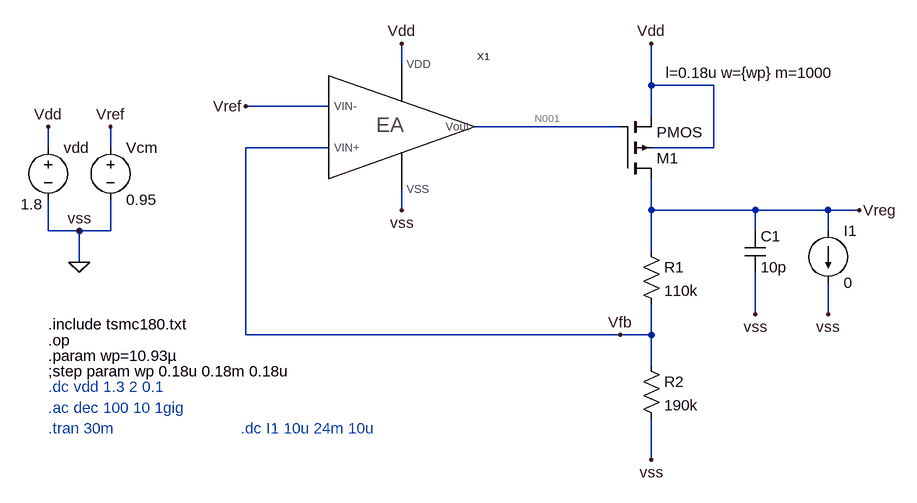
[diagram p0: schematic ldo_24mA.asc]
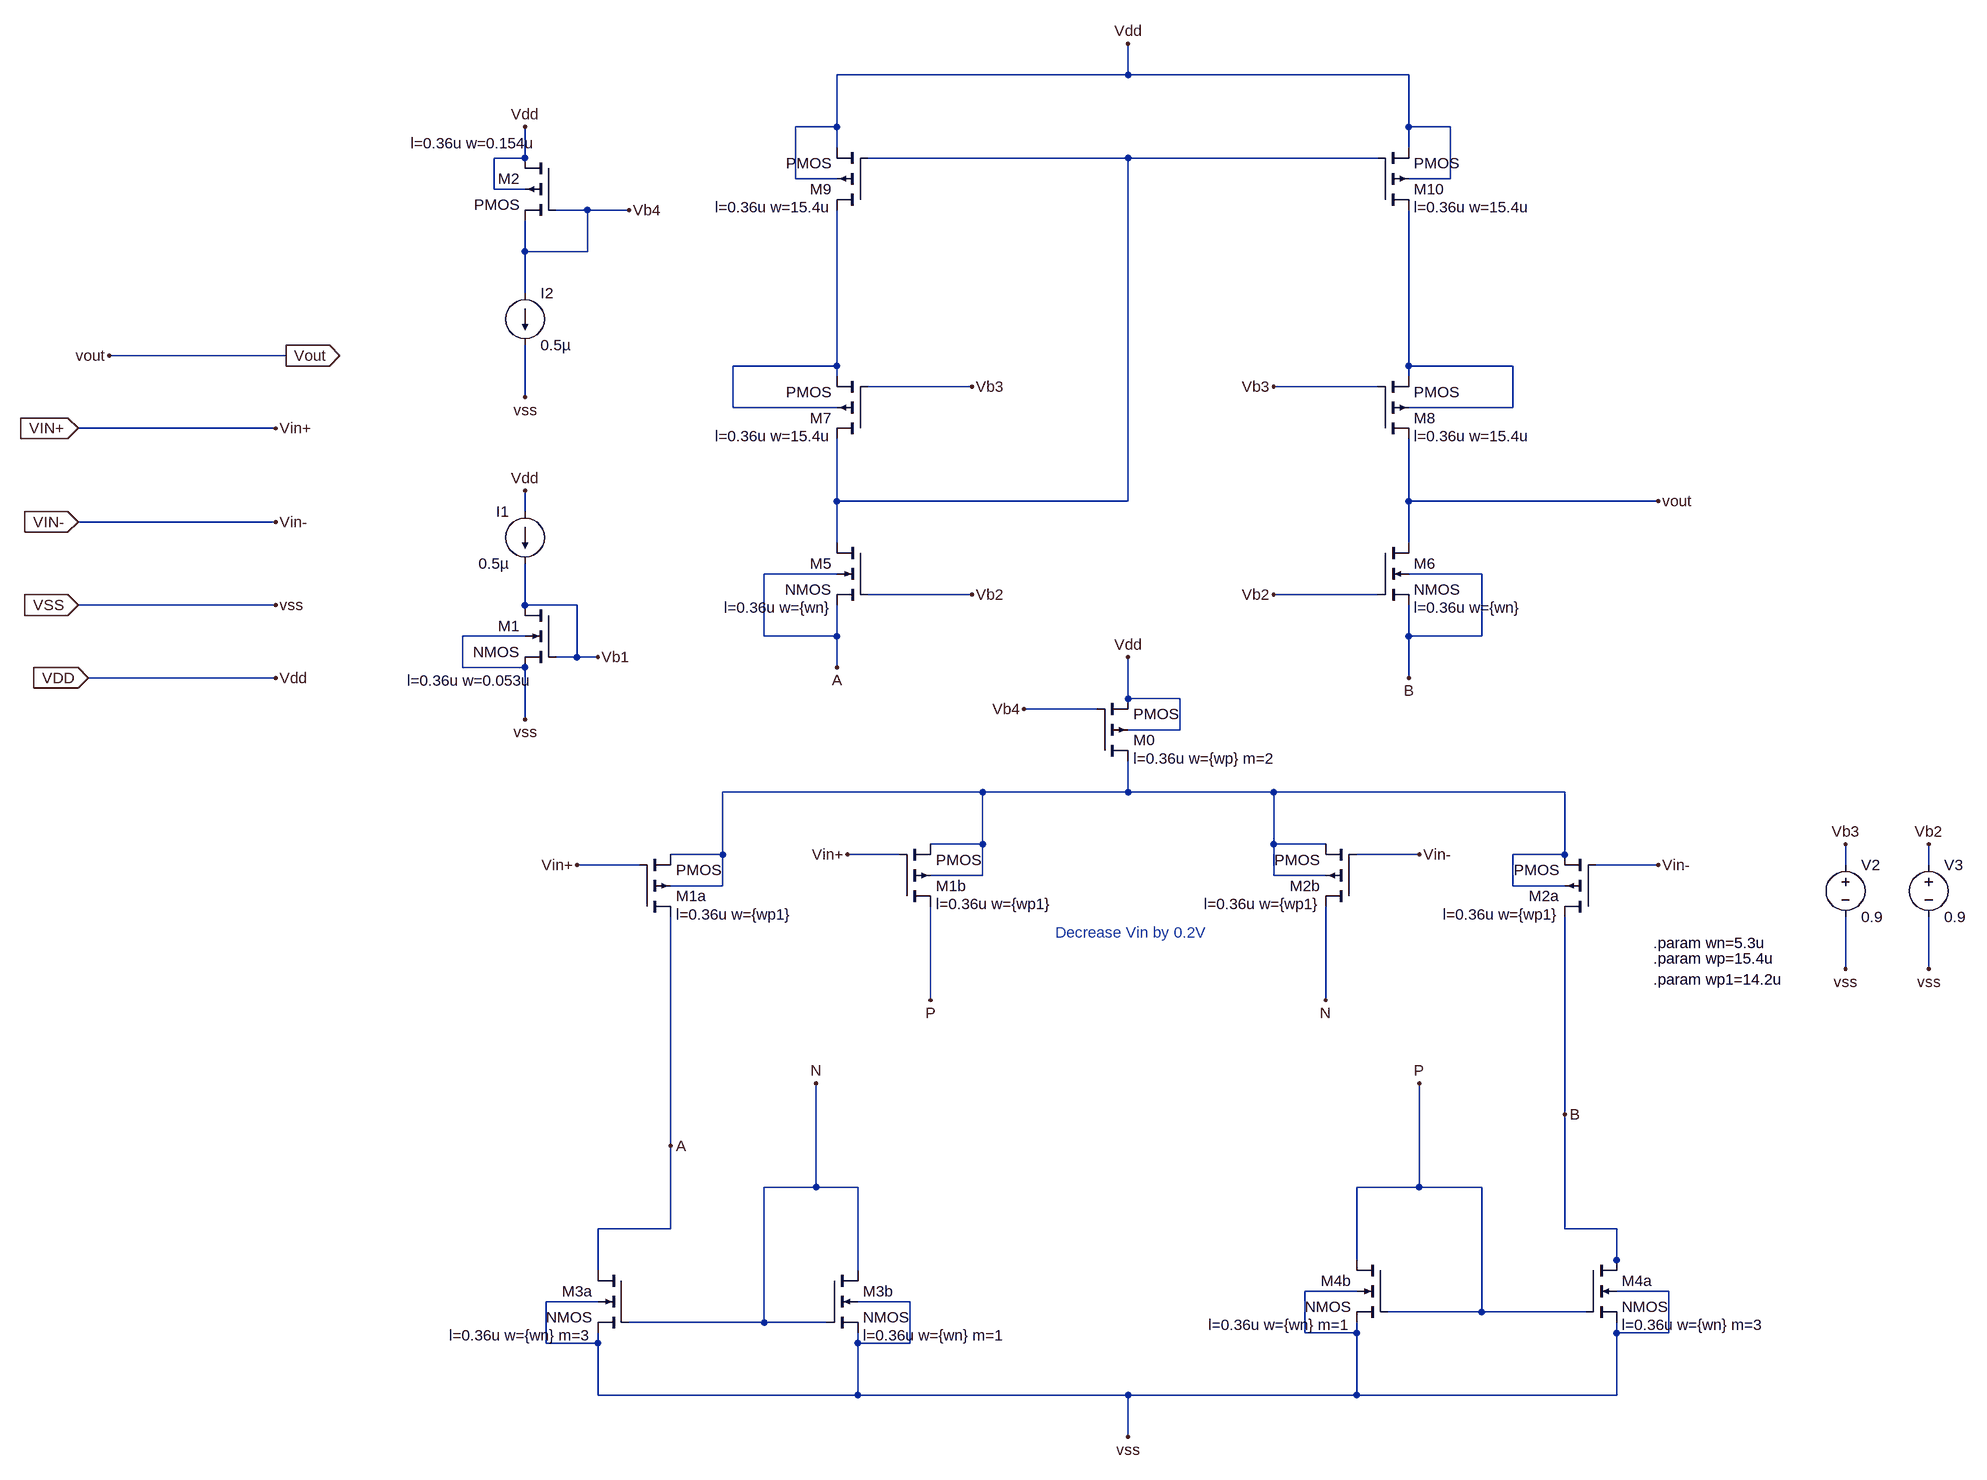
[diagram p1: sub-circuit error_amp.asc]
ldo_24mA.asc, the LTspice schematic file:
Version 4
SHEET 1 1856 756
WIRE 224 64 224 32
WIRE 608 96 608 32
WIRE 704 96 608 96
WIRE 112 128 -16 128
WIRE 608 144 608 96
WIRE 560 160 336 160
WIRE -320 192 -320 160
WIRE -224 192 -224 160
WIRE 112 192 -16 192
WIRE 704 192 704 96
WIRE 704 192 608 192
WIRE 224 288 224 256
WIRE 608 288 608 240
WIRE 768 288 608 288
WIRE 880 288 768 288
WIRE 928 288 880 288
WIRE -320 320 -320 272
WIRE -272 320 -320 320
WIRE -224 320 -224 272
WIRE -224 320 -272 320
WIRE 768 320 768 288
WIRE 880 320 880 288
WIRE 608 352 608 288
WIRE -272 368 -272 320
WIRE 768 448 768 384
WIRE 880 448 880 400
WIRE -16 480 -16 192
WIRE 560 480 -16 480
WIRE 608 480 608 432
WIRE 608 480 560 480
WIRE 608 528 608 480
WIRE 608 672 608 608
FLAG -16 128 Vref
FLAG -224 160 Vref
FLAG -272 368 0
FLAG -272 320 vss
FLAG 224 288 vss
FLAG 224 32 Vdd
FLAG -320 160 Vdd
FLAG 608 672 vss
FLAG 768 448 vss
FLAG 880 448 vss
FLAG 928 288 Vreg
FLAG 608 32 Vdd
FLAG 560 480 Vfb
DATAFLAG 640 288 ""
DATAFLAG 416 480 ""
SYMBOL Error_amp 192 144 R0
SYMATTR InstName X1
SYMBOL voltage -224 176 R0
WINDOW 123 24 124 Left 2
WINDOW 39 0 0 Left 0
SYMATTR InstName Vcm
SYMATTR Value 0.95
SYMBOL voltage -320 176 R0
WINDOW 123 24 124 Left 2
WINDOW 39 0 0 Left 0
WINDOW 3 -42 103 Left 2
SYMATTR Value 1.8
SYMATTR InstName vdd
SYMBOL res 592 336 R0
SYMATTR InstName R1
SYMATTR Value 110k
SYMBOL res 592 512 R0
SYMATTR InstName R2
SYMATTR Value 190k
SYMBOL pmos4 560 240 M180
WINDOW 123 70 163 Left 2
SYMATTR Value2 l=0.18u w={wp} m=1000
SYMATTR InstName M1
SYMBOL current 880 320 R0
WINDOW 123 0 0 Left 0
WINDOW 39 0 0 Left 0
SYMATTR InstName I1
SYMATTR Value 0
SYMBOL cap 752 320 R0
SYMATTR InstName C1
SYMATTR Value 10p
TEXT -320 464 Left 2 !.include tsmc180.txt
TEXT -320 488 Left 2 !.op
TEXT -320 512 Left 2 !.param wp=10.93µ
TEXT -320 536 Left 2 !;step param wp 0.18u 0.18m 0.18u
TEXT -320 560 Left 2 ;.dc vdd 1.3 2 0.1
TEXT -320 592 Left 2 ;.ac dec 100 10 1gig
TEXT -320 624 Left 2 ;.tran 30m
TEXT -24 624 Left 2 ;.dc I1 10u 24m 10u

error_amp.asc, the sub-circuit schematic file:
Version 4
SHEET 1 4352 1320
WIRE -896 -1344 -896 -1392
WIRE -896 -1344 -1344 -1344
WIRE -464 -1344 -896 -1344
WIRE -1344 -1264 -1344 -1344
WIRE -1344 -1264 -1408 -1264
WIRE -464 -1264 -464 -1344
WIRE -400 -1264 -464 -1264
WIRE -1344 -1232 -1344 -1264
WIRE -464 -1232 -464 -1264
WIRE -1824 -1216 -1824 -1264
WIRE -1824 -1216 -1872 -1216
WIRE -896 -1216 -1296 -1216
WIRE -512 -1216 -896 -1216
WIRE -1408 -1184 -1408 -1264
WIRE -1344 -1184 -1408 -1184
WIRE -400 -1184 -400 -1264
WIRE -400 -1184 -464 -1184
WIRE -1872 -1168 -1872 -1216
WIRE -1824 -1168 -1872 -1168
WIRE -1728 -1136 -1776 -1136
WIRE -1664 -1136 -1728 -1136
WIRE -1824 -1072 -1824 -1120
WIRE -1728 -1072 -1728 -1136
WIRE -1728 -1072 -1824 -1072
WIRE -1824 -1008 -1824 -1072
WIRE -2192 -912 -2464 -912
WIRE -1344 -896 -1344 -1136
WIRE -1344 -896 -1504 -896
WIRE -464 -896 -464 -1136
WIRE -304 -896 -464 -896
WIRE -1344 -880 -1344 -896
WIRE -464 -880 -464 -896
WIRE -1136 -864 -1296 -864
WIRE -512 -864 -672 -864
WIRE -1824 -848 -1824 -928
WIRE -1504 -832 -1504 -896
WIRE -1344 -832 -1504 -832
WIRE -304 -832 -304 -896
WIRE -304 -832 -464 -832
WIRE -2208 -800 -2512 -800
WIRE -1344 -688 -1344 -784
WIRE -896 -688 -896 -1216
WIRE -896 -688 -1344 -688
WIRE -464 -688 -464 -784
WIRE -80 -688 -464 -688
WIRE -1824 -672 -1824 -704
WIRE -2208 -656 -2512 -656
WIRE -1344 -624 -1344 -688
WIRE -464 -624 -464 -688
WIRE -1344 -576 -1456 -576
WIRE -352 -576 -464 -576
WIRE -1136 -544 -1296 -544
WIRE -512 -544 -672 -544
WIRE -2208 -528 -2512 -528
WIRE -1824 -528 -1824 -592
WIRE -1744 -528 -1824 -528
WIRE -1824 -480 -1920 -480
WIRE -1456 -480 -1456 -576
WIRE -1344 -480 -1344 -528
WIRE -1344 -480 -1456 -480
WIRE -464 -480 -464 -528
WIRE -352 -480 -352 -576
WIRE -352 -480 -464 -480
WIRE -1744 -448 -1744 -528
WIRE -1744 -448 -1776 -448
WIRE -1712 -448 -1744 -448
WIRE -1920 -432 -1920 -480
WIRE -1824 -432 -1920 -432
WIRE -1344 -432 -1344 -480
WIRE -2208 -416 -2496 -416
WIRE -464 -416 -464 -480
WIRE -896 -384 -896 -448
WIRE -816 -384 -896 -384
WIRE -944 -368 -1056 -368
WIRE -1824 -352 -1824 -432
WIRE -816 -336 -816 -384
WIRE -816 -336 -896 -336
WIRE -1120 -240 -1520 -240
WIRE -896 -240 -896 -288
WIRE -896 -240 -1120 -240
WIRE -672 -240 -896 -240
WIRE -224 -240 -672 -240
WIRE -1120 -160 -1120 -240
WIRE -1120 -160 -1200 -160
WIRE -672 -160 -672 -240
WIRE -592 -160 -672 -160
WIRE -1520 -144 -1520 -240
WIRE -1520 -144 -1600 -144
WIRE -1248 -144 -1328 -144
WIRE -448 -144 -544 -144
WIRE -224 -144 -224 -240
WIRE -224 -144 -304 -144
WIRE -1648 -128 -1744 -128
WIRE -80 -128 -176 -128
WIRE 208 -128 208 -160
WIRE 336 -128 336 -160
WIRE -1120 -112 -1120 -160
WIRE -1120 -112 -1200 -112
WIRE -672 -112 -672 -160
WIRE -592 -112 -672 -112
WIRE -1520 -96 -1520 -144
WIRE -1520 -96 -1600 -96
WIRE -304 -96 -304 -144
WIRE -224 -96 -304 -96
WIRE 208 32 208 -48
WIRE 336 32 336 -48
WIRE -1200 80 -1200 -64
WIRE -592 80 -592 -64
WIRE -224 256 -224 -48
WIRE -1600 304 -1600 -48
WIRE -1376 368 -1376 208
WIRE -1376 368 -1456 368
WIRE -1312 368 -1376 368
WIRE -448 368 -448 208
WIRE -448 368 -544 368
WIRE -352 368 -448 368
WIRE -1600 432 -1600 304
WIRE -1600 432 -1712 432
WIRE -224 432 -224 256
WIRE -144 432 -224 432
WIRE -544 480 -544 368
WIRE -144 480 -144 432
WIRE -1712 496 -1712 432
WIRE -1312 496 -1312 368
WIRE -144 496 -144 480
WIRE -544 528 -624 528
WIRE -64 528 -144 528
WIRE -1712 544 -1792 544
WIRE -1232 544 -1312 544
WIRE -352 560 -352 368
WIRE -352 560 -496 560
WIRE -192 560 -352 560
WIRE -1456 576 -1456 368
WIRE -1456 576 -1664 576
WIRE -1360 576 -1456 576
WIRE -624 592 -624 528
WIRE -544 592 -544 576
WIRE -544 592 -624 592
WIRE -144 592 -144 576
WIRE -64 592 -64 528
WIRE -64 592 -144 592
WIRE -1792 608 -1792 544
WIRE -1712 608 -1712 592
WIRE -1712 608 -1792 608
WIRE -1312 608 -1312 592
WIRE -1232 608 -1232 544
WIRE -1232 608 -1312 608
WIRE -1712 688 -1712 608
WIRE -1312 688 -1312 608
WIRE -1312 688 -1712 688
WIRE -896 688 -1312 688
WIRE -544 688 -544 592
WIRE -544 688 -896 688
WIRE -144 688 -144 592
WIRE -144 688 -544 688
WIRE -896 752 -896 688
FLAG -1712 -448 Vb1
FLAG -1824 -704 Vdd
FLAG -1824 -1264 Vdd
FLAG -1664 -1136 Vb4
FLAG -1136 -864 Vb3
FLAG -1136 -544 Vb2
FLAG 208 -160 Vb3
FLAG 336 -160 Vb2
FLAG -1744 -128 Vin+
FLAG -896 -1392 Vdd
FLAG -672 -864 Vb3
FLAG -672 -544 Vb2
FLAG -80 -128 Vin-
FLAG -1056 -368 Vb4
FLAG -896 -448 Vdd
FLAG -1344 -432 A
FLAG -1600 304 A
FLAG -224 256 B
FLAG -464 -416 B
FLAG -1376 208 N
FLAG -592 80 N
FLAG -1200 80 P
FLAG -448 208 P
FLAG -1328 -144 Vin+
FLAG -448 -144 Vin-
FLAG -80 -688 vout
FLAG -2192 -912 Vout
IOPIN -2192 -912 Out
FLAG -2512 -800 VIN+
IOPIN -2512 -800 In
FLAG -2512 -656 VIN-
IOPIN -2512 -656 In
FLAG -2512 -528 VSS
IOPIN -2512 -528 In
FLAG -2496 -416 VDD
IOPIN -2496 -416 In
FLAG -2208 -416 Vdd
FLAG -2208 -800 Vin+
FLAG -2208 -656 Vin-
FLAG -2464 -912 vout
FLAG -1824 -352 vss
FLAG -1824 -848 vss
FLAG -2208 -528 vss
FLAG -896 752 vss
FLAG 208 32 vss
FLAG 336 32 vss
DATAFLAG -1344 -960 ""
DATAFLAG -208 -688 ""
DATAFLAG -464 -960 ""
SYMBOL nmos4 -1776 -528 M0
WINDOW 123 37 116 Left 2
SYMATTR Value2 l=0.36u w=0.053u
SYMATTR InstName M1
SYMBOL current -1824 -672 M0
WINDOW 123 0 0 Left 0
WINDOW 39 0 0 Left 0
SYMATTR InstName I1
SYMATTR Value 0.5µ
SYMBOL pmos4 -1776 -1216 M0
WINDOW 123 31 -23 Left 2
SYMATTR Value2 l=0.36u w=0.154u
SYMATTR InstName M2
SYMBOL current -1824 -1008 R0
WINDOW 123 0 0 Left 0
WINDOW 39 0 0 Left 0
SYMATTR InstName I2
SYMATTR Value 0.5µ
SYMBOL pmos4 -1296 -1136 R180
WINDOW 123 56 4 Left 2
SYMATTR Value2 l=0.36u w=15.4u
SYMATTR InstName M9
SYMBOL pmos4 -1296 -784 R180
WINDOW 123 56 4 Left 2
SYMATTR Value2 l=0.36u w=15.4u
SYMATTR InstName M7
SYMBOL nmos4 -1296 -624 M0
WINDOW 123 56 100 Left 2
SYMATTR Value2 l=0.36u w={wn}
SYMATTR InstName M5
SYMBOL nmos4 -1360 496 R0
WINDOW 123 56 100 Left 2
SYMATTR Value2 l=0.36u w={wn} m=1
SYMATTR InstName M3b
SYMBOL voltage 208 -144 R0
WINDOW 123 0 0 Left 0
WINDOW 39 0 0 Left 0
SYMATTR InstName V2
SYMATTR Value 0.9
SYMBOL voltage 336 -144 R0
WINDOW 123 0 0 Left 0
WINDOW 39 0 0 Left 0
SYMATTR InstName V3
SYMATTR Value 0.9
SYMBOL pmos4 -1648 -48 M180
WINDOW 123 56 4 Left 2
SYMATTR Value2 l=0.36u w={wp1}
SYMATTR InstName M1a
SYMBOL pmos4 -512 -1136 M180
WINDOW 123 56 4 Left 2
SYMATTR Value2 l=0.36u w=15.4u
SYMATTR InstName M10
SYMBOL pmos4 -512 -784 M180
WINDOW 123 56 4 Left 2
SYMATTR Value2 l=0.36u w=15.4u
SYMATTR InstName M8
SYMBOL nmos4 -512 -624 R0
WINDOW 123 56 100 Left 2
SYMATTR Value2 l=0.36u w={wn}
SYMATTR InstName M6
SYMBOL nmos4 -496 480 M0
WINDOW 123 56 100 Left 2
SYMATTR Value2 l=0.36u w={wn} m=1
SYMATTR InstName M4b
SYMBOL pmos4 -176 -48 R180
WINDOW 123 56 4 Left 2
SYMATTR Value2 l=0.36u w={wp1}
SYMATTR InstName M2a
SYMBOL pmos4 -944 -288 M180
WINDOW 123 56 4 Left 2
SYMATTR Value2 l=0.36u w={wp} m=2
SYMATTR InstName M0
SYMATTR Prefix M0
SYMBOL pmos4 -1248 -64 M180
WINDOW 123 56 4 Left 2
SYMATTR Value2 l=0.36u w={wp1}
SYMATTR InstName M1b
SYMBOL nmos4 -1664 496 M0
WINDOW 123 56 100 Left 2
SYMATTR Value2 l=0.36u w={wn} m=3
SYMATTR InstName M3a
SYMBOL pmos4 -544 -64 R180
WINDOW 123 56 4 Left 2
SYMATTR Value2 l=0.36u w={wp1}
SYMATTR InstName M2b
SYMBOL nmos4 -192 480 R0
WINDOW 123 56 100 Left 2
SYMATTR Value2 l=0.36u w={wn} m=3
SYMATTR InstName M4a
TEXT -88 -8 Left 2 !.param wn=5.3u
TEXT -88 16 Left 2 !.param wp=15.4u
TEXT -88 48 Left 2 !.param wp1=14.2u
TEXT -1008 -24 Left 2 ;Decrease Vin by 0.2V

The netlist it stands for:
* ldo_24mA.asc
XX1 Vdd Vfb Vref 0 N001 error_amp
Vcm Vref 0 0.95
vdd Vdd 0 1.8
R1 Vreg Vfb 110k
R2 Vfb 0 190k
M1 Vreg N001 Vdd Vdd PMOS l=0.18u w={wp} m=1000
I1 Vreg 0 0
C1 Vreg 0 10p

* block symbol definitions
.subckt error_amp VDD VIN+ VIN- VSS Vout
M1 Vb1 Vb1 VSS VSS NMOS l=0.36u w=0.053u
I1 Vdd Vb1 0.5µ
M2 Vdd Vb4 Vb4 Vdd PMOS l=0.36u w=0.154u
I2 Vb4 VSS 0.5µ
M9 N002 N001 Vdd Vdd PMOS l=0.36u w=15.4u
M7 N001 Vb3 N002 N002 PMOS l=0.36u w=15.4u
M5 N001 Vb2 A A NMOS l=0.36u w={wn}
M3b N N VSS VSS NMOS l=0.36u w={wn} m=1
V2 Vb3 VSS 0.9
V3 Vb2 VSS 0.9
M1a A Vin+ N004 N004 PMOS l=0.36u w={wp1}
M10 N003 N001 Vdd Vdd PMOS l=0.36u w=15.4u
M8 vout Vb3 N003 N003 PMOS l=0.36u w=15.4u
M6 vout Vb2 B B NMOS l=0.36u w={wn}
M4b P P VSS VSS NMOS l=0.36u w={wn} m=1
M2a B Vin- N004 N004 PMOS l=0.36u w={wp1}
M0 N004 Vb4 Vdd Vdd PMOS l=0.36u w={wp} m=2
M1b P Vin+ N004 N004 PMOS l=0.36u w={wp1}
M3a A N VSS VSS NMOS l=0.36u w={wn} m=3
M2b N Vin- N004 N004 PMOS l=0.36u w={wp1}
M4a B P VSS VSS NMOS l=0.36u w={wn} m=3
.param wn=5.3u
.param wp=15.4u
.param wp1=14.2u
* Decrease Vin by 0.2V
.ends error_amp

.model NMOS NMOS
.model PMOS PMOS
.lib standard.mos
.include tsmc180.txt
.op
.param wp=10.93µ
;step param wp 0.18u 0.18m 0.18u
* .dc vdd 1.3 2 0.1
* .ac dec 100 10 1gig
* .tran 30m
* .dc I1 10u 24m 10u
.backanno
.end

* Results of the author's LTspice run, read from the files saved beside the schematic
* Operating Point:
*   V(vdd) = 1.8 V
*   V(vfb) = 950.7 mV
*   V(n001) = 1.57 V
*   V(vref) = 950 mV
*   V(vreg) = 1.501 V
*   Id(M1) = -5.004 µA
*   Ig(M1) = 0 A
*   Ib(M1) = 308.9 pA
*   Is(M1) = 5.003 µA
*   I(C1) = 0 A
*   I(I1) = 0 A
*   I(R1) = 5.004 µA
*   I(R2) = 5.004 µA
*   I(Vcm) = 0 A
*   I(Vdd) = -127.4 µA
*   Ix(x1:VDD) = 122.4 µA
*   Ix(x1:VIN+) = 0 A
*   Ix(x1:VIN-) = 0 A
*   Ix(x1:VSS) = -122.4 µA
*   Ix(x1:VOUT) = -292.8 pA
* From the log:
*   Semiconductor Device Operating Points:
*                           --- BSIM3 MOSFETS ---
*   Name:      m:x1:1      m:x1:5      m:x1:3b     m:x1:6      m:x1:4b
*   Model:      nmos        nmos        nmos        nmos        nmos
*   Id:        5.00e-07    2.90e-05    1.59e-05    2.84e-05    1.57e-05
*   Vgs:       6.84e-01    6.07e-01    5.74e-01    6.03e-01    5.74e-01
*   Vds:       6.84e-01    9.02e-01    5.74e-01    1.27e+00    5.74e-01
*   Vbs:       0.00e+00    0.00e+00    0.00e+00    0.00e+00    0.00e+00
*   Vth:       5.41e-01    4.67e-01    4.67e-01    4.67e-01    4.67e-01
*   Vdsat:     1.08e-01    1.10e-01    8.85e-02    1.07e-01    8.82e-02
*   Gm:        7.66e-06    4.47e-04    2.88e-04    4.41e-04    2.86e-04
*   Gds:       5.70e-08    3.79e-06    2.64e-06    3.52e-06    2.62e-06
*   Gmb        1.65e-06    1.18e-04    7.67e-05    1.16e-04    7.60e-05
*   Cbd:       0.00e+00    0.00e+00    0.00e+00    0.00e+00    0.00e+00
*   Cbs:       0.00e+00    0.00e+00    0.00e+00    0.00e+00    0.00e+00
*   Cgsov:     4.08e-17    4.08e-15    4.08e-15    4.08e-15    4.08e-15
*   Cgdov:     4.08e-17    4.08e-15    4.08e-15    4.08e-15    4.08e-15
*   Cgbov:     3.33e-19    3.33e-19    3.33e-19    3.33e-19    3.33e-19
*   dQgdVgb:   2.06e-16    2.04e-14    2.02e-14    2.04e-14    2.02e-14
*   dQgdVdb:  -4.08e-17   -4.08e-15   -4.08e-15   -4.08e-15   -4.08e-15
*   dQgdVsb:  -1.50e-16   -1.54e-14   -1.50e-14   -1.54e-14   -1.50e-14
*   dQddVgb:  -8.93e-17   -8.92e-15   -8.77e-15   -8.91e-15   -8.77e-15
*   dQddVdb:   4.08e-17    4.08e-15    4.08e-15    4.08e-15    4.08e-15
*   dQddVsb:   6.00e-17    6.27e-15    6.08e-15    6.25e-15    6.07e-15
*   dQbdVgb:  -2.70e-17   -2.59e-15   -2.62e-15   -2.59e-15   -2.62e-15
*   dQbdVdb:  -2.06e-20   -7.68e-19   -2.47e-18   -1.86e-19   -2.47e-18
*   dQbdVsb:  -1.10e-17   -1.23e-15   -1.20e-15   -1.22e-15   -1.20e-15
*   Name:      m:x1:3a     m:x1:4a     m:x1:2      m:x1:9      m:x1:7
*   Model:      nmos        nmos        pmos        pmos        pmos
*   Id:        4.51e-05    4.47e-05    5.00e-07   -2.90e-05   -2.90e-05
*   Vgs:       5.74e-01    5.74e-01    0.00e+00   -6.06e-01   -6.06e-01
*   Vds:       2.93e-01    2.97e-01    6.13e-01   -2.94e-01   -3.11e-01
*   Vbs:       0.00e+00    0.00e+00    6.13e-01    0.00e+00    0.00e+00
*   Vth:       4.67e-01    4.67e-01   -4.25e-01   -4.73e-01   -4.73e-01
*   Vdsat:     8.85e-02    8.82e-02   -1.61e-01   -1.29e-01   -1.29e-01
*   Gm:        8.27e-04    8.21e-04    5.17e-06    3.73e-04    3.74e-04
*   Gds:       1.03e-05    1.01e-05    5.08e-08    3.75e-06    3.54e-06
*   Gmb        2.20e-04    2.19e-04    1.77e-06    1.17e-04    1.17e-04
*   Cbd:       0.00e+00    0.00e+00    0.00e+00    0.00e+00    0.00e+00
*   Cbs:       0.00e+00    0.00e+00    0.00e+00    0.00e+00    0.00e+00
*   Cgsov:     1.22e-14    1.22e-14    1.09e-16    1.09e-14    1.09e-14
*   Cgdov:     1.22e-14    1.22e-14    1.09e-16    1.09e-14    1.09e-14
*   Cgbov:     9.99e-19    9.99e-19    3.11e-19    3.11e-19    3.11e-19
*   dQgdVgb:   6.06e-14    6.06e-14    5.56e-16    5.52e-14    5.52e-14
*   dQgdVdb:  -1.23e-14   -1.23e-14   -1.09e-16   -1.10e-14   -1.10e-14
*   dQgdVsb:  -4.51e-14   -4.51e-14   -4.44e-16   -4.26e-14   -4.26e-14
*   dQddVgb:  -2.64e-14   -2.64e-14   -2.41e-16   -2.41e-14   -2.41e-14
*   dQddVdb:   1.23e-14    1.23e-14    1.09e-16    1.10e-14    1.10e-14
*   dQddVsb:   1.83e-14    1.83e-14    1.80e-16    1.73e-14    1.73e-14
*   dQbdVgb:  -7.77e-15   -7.78e-15   -7.37e-17   -7.02e-15   -7.03e-15
*   dQbdVdb:  -6.34e-17   -5.99e-17   -1.22e-19   -7.82e-17   -6.52e-17
*   dQbdVsb:  -3.67e-15   -3.66e-15   -2.49e-17   -2.93e-15   -2.93e-15
*   Name:      m:x1:1a     m:x1:10     m:x1:8      m:x1:2a     m:x1:0
*   Model:      pmos        pmos        pmos        pmos        pmos
*   Id:       -1.61e-05   -2.84e-05   -2.84e-05   -1.63e-05   -6.39e-05
*   Vgs:      -5.64e-01   -6.06e-01   -7.11e-01   -5.64e-01   -6.13e-01
*   Vds:      -1.22e+00   -1.89e-01   -4.16e-02   -1.22e+00   -2.86e-01
*   Vbs:       0.00e+00    0.00e+00    0.00e+00    0.00e+00    0.00e+00
*   Vth:      -4.73e-01   -4.73e-01   -4.73e-01   -4.73e-01   -4.73e-01
*   Vdsat:    -1.01e-01   -1.29e-01   -2.09e-01   -1.02e-01   -1.35e-01
*   Gm:        2.53e-04    3.61e-04    1.35e-04    2.54e-04    7.91e-04
*   Gds:       1.44e-06    1.08e-05    6.04e-04    1.46e-06    8.75e-06
*   Gmb        7.94e-05    1.13e-04    4.76e-05    8.00e-05    2.48e-04
*   Cbd:       0.00e+00    0.00e+00    0.00e+00    0.00e+00    0.00e+00
*   Cbs:       0.00e+00    0.00e+00    0.00e+00    0.00e+00    0.00e+00
*   Cgsov:     1.01e-14    1.09e-14    1.09e-14    1.01e-14    2.19e-14
*   Cgdov:     1.01e-14    1.09e-14    1.09e-14    1.01e-14    2.19e-14
*   Cgbov:     3.11e-19    3.11e-19    3.11e-19    3.11e-19    6.21e-19
*   dQgdVgb:   4.96e-14    5.54e-14    6.15e-14    4.96e-14    1.11e-13
*   dQgdVdb:  -1.01e-14   -1.13e-14   -2.42e-14   -1.01e-14   -2.21e-14
*   dQgdVsb:  -3.76e-14   -4.27e-14   -3.77e-14   -3.77e-14   -8.56e-14
*   dQddVgb:  -2.14e-14   -2.43e-14   -3.02e-14   -2.15e-14   -4.83e-14
*   dQddVdb:   1.01e-14    1.13e-14    2.44e-14    1.01e-14    2.21e-14
*   dQddVsb:   1.50e-14    1.74e-14    1.19e-14    1.50e-14    3.48e-14
*   dQbdVgb:  -6.71e-15   -6.79e-15   -1.06e-15   -6.70e-15   -1.40e-14
*   dQbdVdb:  -5.02e-19   -3.31e-16   -1.37e-14   -5.12e-19   -1.89e-16
*   dQbdVsb:  -2.53e-15   -2.98e-15    2.90e-15   -2.53e-15   -5.88e-15
*   Name:      m:x1:1b     m:x1:2b       m1
*   Model:      pmos        pmos        pmos
*   Id:       -1.57e-05   -1.59e-05   -5.00e-06
*   Vgs:      -5.64e-01   -5.64e-01   -2.30e-01
*   Vds:      -9.41e-01   -9.40e-01   -2.99e-01
*   Vbs:       0.00e+00    0.00e+00    0.00e+00
*   Vth:      -4.73e-01   -4.73e-01   -5.23e-01
*   Vdsat:    -1.01e-01   -1.02e-01   -4.08e-02
*   Gm:        2.46e-04    2.48e-04    1.27e-04
*   Gds:       1.45e-06    1.46e-06    1.69e-06
*   Gmb        7.74e-05    7.80e-05    4.48e-05
*   Cbd:       0.00e+00    0.00e+00    0.00e+00
*   Cbs:       0.00e+00    0.00e+00    0.00e+00
*   Cgsov:     1.01e-14    1.01e-14    7.77e-12
*   Cgdov:     1.01e-14    1.01e-14    7.77e-12
*   Cgbov:     3.11e-19    3.11e-19    1.31e-16
*   dQgdVgb:   4.96e-14    4.96e-14    1.87e-11
*   dQgdVdb:  -1.01e-14   -1.01e-14   -7.77e-12
*   dQgdVsb:  -3.76e-14   -3.77e-14   -7.78e-12
*   dQddVgb:  -2.14e-14   -2.15e-14   -7.77e-12
*   dQddVdb:   1.01e-14    1.01e-14    7.77e-12
*   dQddVsb:   1.50e-14    1.50e-14    2.91e-15
*   dQbdVgb:  -6.71e-15   -6.70e-15   -3.17e-12
*   dQbdVdb:  -1.16e-18   -1.17e-18   -4.25e-19
*   dQbdVsb:  -2.53e-15   -2.54e-15   -4.48e-16